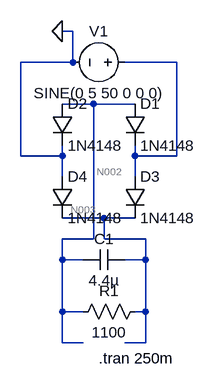
[diagram p0: schematic 151_rectifier.asc]
151_rectifier.asc, the LTspice schematic file:
Version 4
SHEET 1 880 1140
WIRE 448 592 432 592
WIRE 448 640 448 592
WIRE 448 640 368 640
WIRE 608 640 528 640
WIRE 480 704 432 704
WIRE 544 704 480 704
WIRE 368 784 368 640
WIRE 432 784 432 768
WIRE 432 784 368 784
WIRE 544 784 544 768
WIRE 608 784 608 640
WIRE 608 784 544 784
WIRE 432 816 432 784
WIRE 544 816 544 784
WIRE 496 880 432 880
WIRE 544 880 496 880
WIRE 480 912 480 704
WIRE 480 912 432 912
WIRE 496 912 496 880
WIRE 560 912 496 912
WIRE 432 944 432 912
WIRE 464 944 432 944
WIRE 560 944 560 912
WIRE 560 944 528 944
WIRE 432 1024 432 944
WIRE 464 1024 432 1024
WIRE 560 1024 560 944
WIRE 560 1024 544 1024
WIRE 432 1072 432 1024
WIRE 464 1072 432 1072
WIRE 560 1072 560 1024
WIRE 560 1072 528 1072
FLAG 432 592 0
SYMBOL diode 528 704 R0
SYMATTR InstName D1
SYMATTR Value 1N4148
SYMBOL diode 416 704 R0
SYMATTR InstName D2
SYMATTR Value 1N4148
SYMBOL diode 528 816 R0
SYMATTR InstName D3
SYMATTR Value 1N4148
SYMBOL diode 416 816 R0
SYMATTR InstName D4
SYMATTR Value 1N4148
SYMBOL voltage 544 640 R90
WINDOW 0 -32 56 VBottom 2
WINDOW 3 32 56 VTop 2
SYMATTR InstName V1
SYMATTR Value SINE(0 5 50 0 0 0)
SYMBOL Res 560 1008 R90
WINDOW 0 0 56 VBottom 2
WINDOW 3 32 56 VTop 2
SYMATTR InstName R1
SYMATTR Value 1100
SYMBOL Cap 528 928 R90
WINDOW 0 0 32 VBottom 2
WINDOW 3 32 32 VTop 2
SYMATTR InstName C1
SYMATTR Value 4.4µ
TEXT 488 1096 Left 2 !.tran 250m

The netlist it stands for:
* 151_rectifier.asc
D1 N002 N001 1N4148
D2 N002 0 1N4148
D3 N001 N003 1N4148
D4 0 N003 1N4148
V1 N001 0 SINE(0 5 50 0 0 0)
R1 N003 N002 1100
C1 N003 N002 4.4µ
.model D D
.lib standard.dio
.tran 250m
.backanno
.end

* Results of the author's LTspice run, read from the files saved beside the schematic
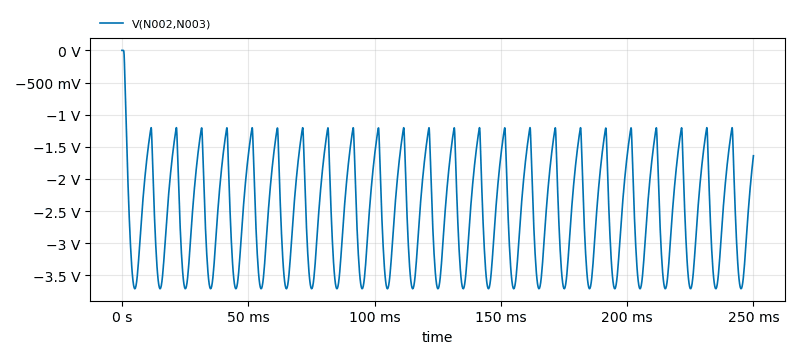
[diagram p1: Transient Analysis of 151_rectifier.asc, plotted from the saved traces]
* Transient Analysis, 1 run:
*   V(N002,N003): min -3.708 V, max 0 V, average -2.533 V, rms 2.672 V, last -1.638 V